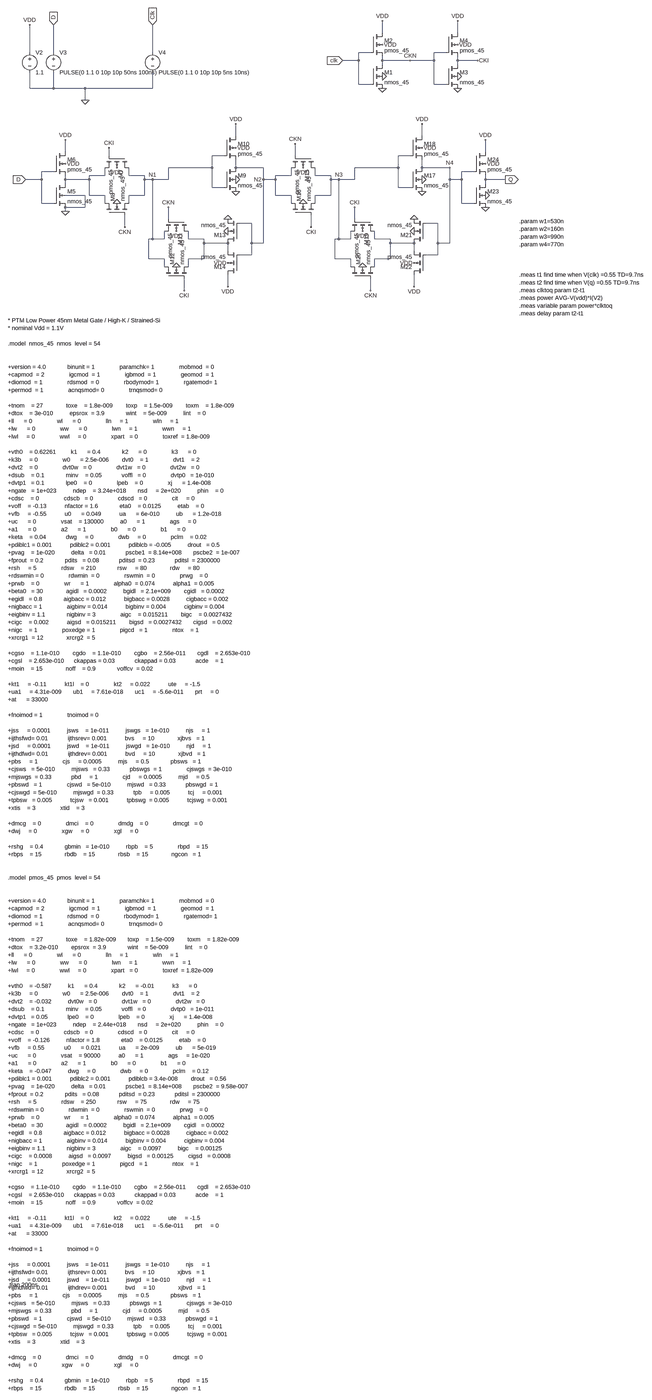
[diagram p0: schematic TGFF.asc, whole sheet]
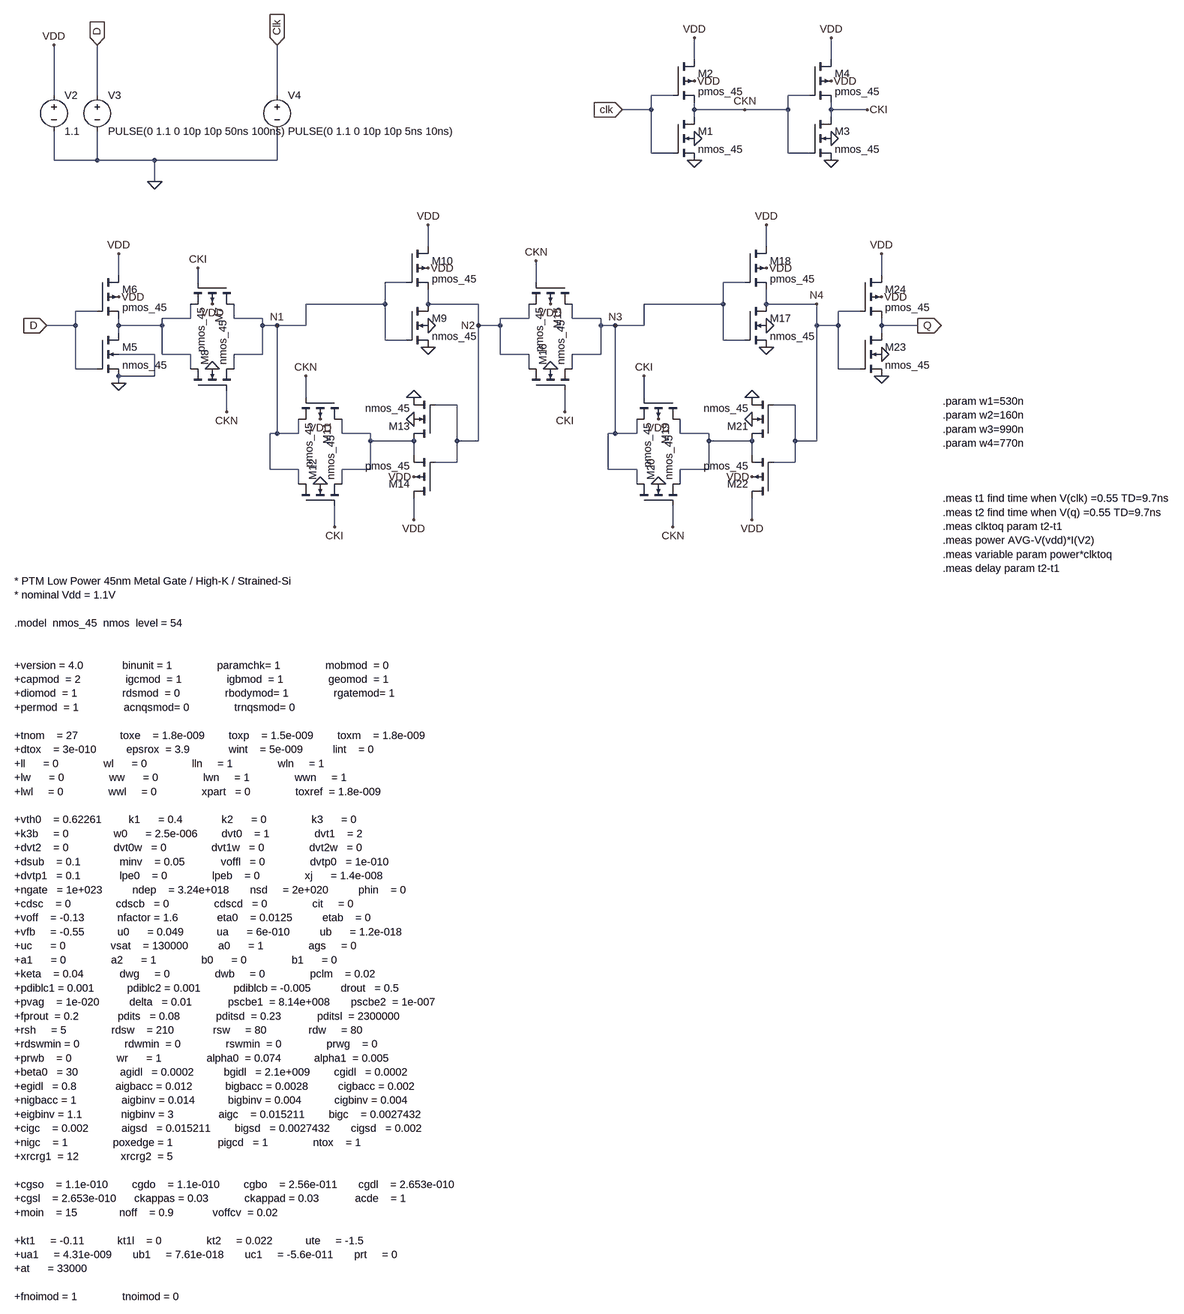
[diagram p1: schematic TGFF.asc, part, row 1 of 2, column 1 of 1]
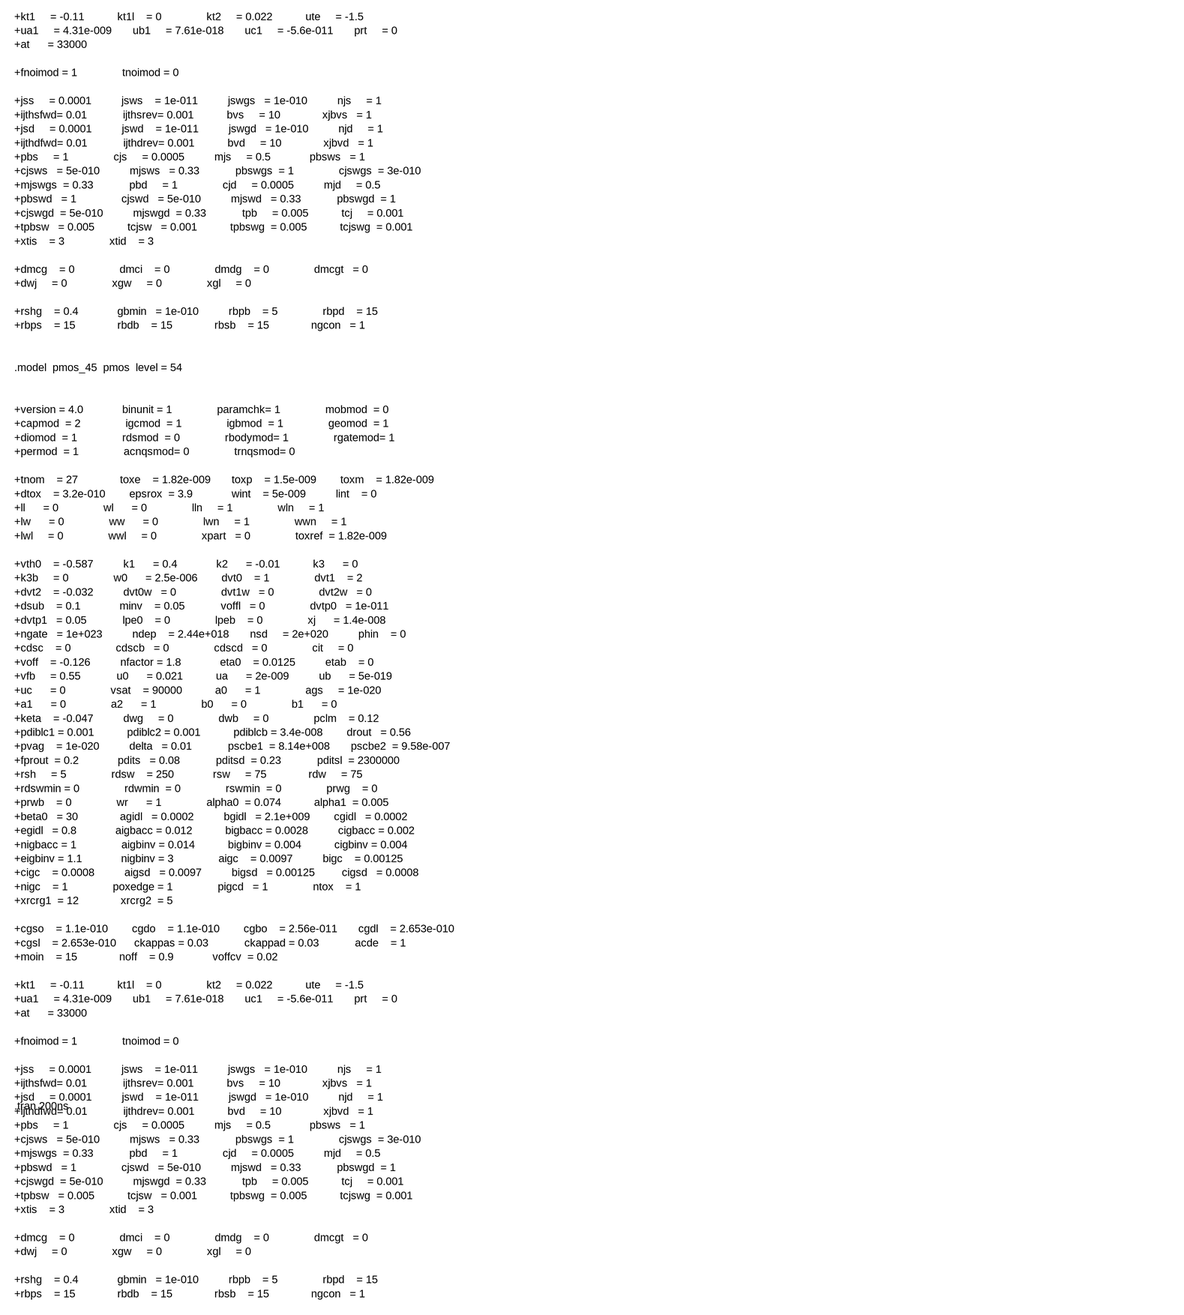
[diagram p2: schematic TGFF.asc, part, row 2 of 2, column 1 of 1]
TGFF.asc, the LTspice schematic file:
Version 4
SHEET 1 1576 4968
WIRE 192 -96 192 -144
WIRE 496 -96 496 -144
WIRE -1232 -16 -1232 -128
WIRE -1136 -16 -1136 -128
WIRE -736 -16 -736 -128
WIRE 144 -16 96 -16
WIRE 448 -16 400 -16
WIRE 96 16 96 -16
WIRE 96 16 32 16
WIRE 192 16 192 0
WIRE 304 16 192 16
WIRE 400 16 400 -16
WIRE 400 16 304 16
WIRE 496 16 496 0
WIRE 576 16 496 16
WIRE 192 32 192 16
WIRE 496 32 496 16
WIRE 96 112 96 16
WIRE 144 112 96 112
WIRE 400 112 400 16
WIRE 448 112 400 112
WIRE -1232 128 -1232 64
WIRE -1136 128 -1136 64
WIRE -1136 128 -1232 128
WIRE -1008 128 -1136 128
WIRE -736 128 -736 64
WIRE -736 128 -1008 128
WIRE -1008 176 -1008 128
WIRE -400 320 -400 272
WIRE 352 320 352 272
WIRE -1088 384 -1088 336
WIRE 608 384 608 336
WIRE -912 400 -912 368
WIRE -448 400 -496 400
WIRE -160 400 -160 352
WIRE 304 400 256 400
WIRE -496 448 -496 400
WIRE -496 448 -672 448
WIRE -400 448 -400 416
WIRE -288 448 -400 448
WIRE 256 448 256 400
WIRE 256 448 80 448
WIRE 352 448 352 416
WIRE 464 448 352 448
WIRE -1136 464 -1184 464
WIRE 560 464 512 464
WIRE -928 480 -928 448
WIRE -928 480 -992 480
WIRE -832 480 -832 448
WIRE -768 480 -832 480
WIRE -176 480 -176 448
WIRE -176 480 -240 480
WIRE -80 480 -80 448
WIRE -16 480 -80 480
WIRE -1184 496 -1184 464
WIRE -1184 496 -1248 496
WIRE -1088 496 -1088 480
WIRE -992 496 -992 480
WIRE -992 496 -1088 496
WIRE -768 496 -768 480
WIRE -736 496 -768 496
WIRE -672 496 -672 448
WIRE -672 496 -736 496
WIRE -288 496 -288 448
WIRE -240 496 -240 480
WIRE -240 496 -288 496
WIRE -16 496 -16 480
WIRE 16 496 -16 496
WIRE 80 496 80 448
WIRE 80 496 16 496
WIRE 464 496 464 448
WIRE 512 496 512 464
WIRE 512 496 464 496
WIRE 608 496 608 480
WIRE 688 496 608 496
WIRE -1088 512 -1088 496
WIRE 608 512 608 496
WIRE -496 528 -496 448
WIRE -448 528 -496 528
WIRE 256 528 256 448
WIRE 304 528 256 528
WIRE -1008 560 -1088 560
WIRE -992 560 -992 496
WIRE -928 560 -992 560
WIRE -768 560 -768 496
WIRE -768 560 -832 560
WIRE -240 560 -240 496
WIRE -176 560 -240 560
WIRE -16 560 -16 496
WIRE -16 560 -80 560
WIRE -1184 592 -1184 496
WIRE -1136 592 -1184 592
WIRE -928 592 -928 560
WIRE -832 592 -832 560
WIRE -176 592 -176 560
WIRE -80 592 -80 560
WIRE 512 592 512 496
WIRE 560 592 512 592
WIRE -1008 608 -1008 560
WIRE -1008 608 -1088 608
WIRE -1088 624 -1088 608
WIRE -672 656 -672 608
WIRE 80 656 80 608
WIRE -336 672 -384 672
WIRE 416 672 368 672
WIRE -848 688 -848 640
WIRE -96 688 -96 640
WIRE -736 736 -736 496
WIRE -736 736 -752 736
WIRE -688 736 -688 704
WIRE -688 736 -736 736
WIRE -592 736 -592 704
WIRE -528 736 -592 736
WIRE 16 736 16 496
WIRE 16 736 0 736
WIRE 64 736 64 704
WIRE 64 736 16 736
WIRE 160 736 160 704
WIRE 224 736 160 736
WIRE -528 752 -528 736
WIRE -432 752 -528 752
WIRE -336 752 -336 672
WIRE -288 752 -288 496
WIRE -288 752 -336 752
WIRE 224 752 224 736
WIRE 320 752 224 752
WIRE 416 752 416 672
WIRE 464 752 464 496
WIRE 464 752 416 752
WIRE -432 784 -432 752
WIRE 320 784 320 752
WIRE -336 800 -336 752
WIRE -336 800 -384 800
WIRE 416 800 416 752
WIRE 416 800 368 800
WIRE -752 816 -752 736
WIRE -688 816 -752 816
WIRE -528 816 -528 752
WIRE -528 816 -592 816
WIRE 0 816 0 736
WIRE 64 816 0 816
WIRE 224 816 224 752
WIRE 224 816 160 816
WIRE -688 848 -688 816
WIRE -592 848 -592 816
WIRE 64 848 64 816
WIRE 160 848 160 816
WIRE -432 928 -432 880
WIRE 320 928 320 880
WIRE -608 944 -608 896
WIRE 144 944 144 896
FLAG 192 128 0
FLAG 192 -144 VDD
FLAG 496 128 0
FLAG 496 -144 VDD
FLAG -1136 -128 D
IOPIN -1136 -128 In
FLAG -736 -128 Clk
IOPIN -736 -128 In
FLAG -1232 -128 VDD
FLAG -1008 176 0
FLAG 32 16 clk
IOPIN 32 16 In
FLAG 304 16 CKN
FLAG 576 16 CKI
FLAG -1088 624 0
FLAG -1088 336 VDD
FLAG -400 544 0
FLAG -400 272 VDD
FLAG -432 656 0
FLAG -432 928 VDD
FLAG 352 544 0
FLAG 352 272 VDD
FLAG 320 656 0
FLAG 320 928 VDD
FLAG 608 608 0
FLAG 608 336 VDD
FLAG -1248 496 D
IOPIN -1248 496 In
FLAG 688 496 Q
IOPIN 688 496 Out
FLAG 352 368 VDD
FLAG 352 496 0
FLAG 320 704 0
FLAG -432 704 0
FLAG 608 560 0
FLAG 112 848 0
FLAG -640 848 0
FLAG -880 592 0
FLAG -128 592 0
FLAG 608 432 VDD
FLAG 320 832 VDD
FLAG 112 704 VDD
FLAG -128 448 VDD
FLAG -400 368 VDD
FLAG -880 448 VDD
FLAG -1088 432 VDD
FLAG -640 704 VDD
FLAG -432 832 VDD
FLAG -400 496 0
FLAG -912 368 CKI
FLAG -848 688 CKN
FLAG -672 608 CKN
FLAG -608 944 CKI
FLAG 80 608 CKI
FLAG 144 944 CKN
FLAG -160 352 CKN
FLAG -96 688 CKI
FLAG 464 448 N4
FLAG 16 496 N3
FLAG -288 496 N2
FLAG -736 496 N1
FLAG 192 80 0
FLAG 496 80 0
FLAG 192 -48 VDD
FLAG 496 -48 VDD
SYMBOL nmos4 144 32 R0
SYMATTR InstName M1
SYMATTR Value nmos_45
SYMATTR Value2 l=45n w=90n
SYMBOL pmos4 144 -96 R0
SYMATTR InstName M2
SYMATTR Value pmos_45
SYMATTR Value2 l=45n w=180n
SYMBOL nmos4 448 32 R0
SYMATTR InstName M3
SYMATTR Value nmos_45
SYMATTR Value2 l=45n w=90n
SYMBOL pmos4 448 -96 R0
SYMATTR InstName M4
SYMATTR Value pmos_45
SYMATTR Value2 l=45n w=180n
SYMBOL voltage -1232 -32 R0
WINDOW 123 0 0 Left 0
WINDOW 39 0 0 Left 0
SYMATTR InstName V2
SYMATTR Value 1.1
SYMBOL voltage -1136 -32 R0
WINDOW 123 0 0 Left 0
WINDOW 39 0 0 Left 0
SYMATTR InstName V3
SYMATTR Value PULSE(0 1.1 0 10p 10p 50ns 100ns)
SYMBOL voltage -736 -32 R0
WINDOW 123 0 0 Left 0
WINDOW 39 0 0 Left 0
SYMATTR InstName V4
SYMATTR Value PULSE(0 1.1 0 10p 10p 5ns 10ns)
SYMBOL nmos4 -1136 512 R0
SYMATTR InstName M5
SYMATTR Value nmos_45
SYMATTR Value2 l=45n w=90n
SYMBOL pmos4 -1136 384 R0
SYMATTR InstName M6
SYMATTR Value pmos_45
SYMATTR Value2 l=45n w=180n
SYMBOL pmos4 -832 400 R90
SYMATTR InstName M7
SYMATTR Value pmos_45
SYMATTR Value2 l=45n w=180n
SYMBOL nmos4 -928 640 R270
SYMATTR InstName M8
SYMATTR Value nmos_45
SYMATTR Value2 l=45n w={w1}
SYMBOL nmos4 -448 448 R0
SYMATTR InstName M9
SYMATTR Value nmos_45
SYMATTR Value2 l=45n w=90n
SYMBOL pmos4 -448 320 R0
SYMATTR InstName M10
SYMATTR Value pmos_45
SYMATTR Value2 l=45n w=180n
SYMBOL pmos4 -592 656 R90
SYMATTR InstName M11
SYMATTR Value pmos_45
SYMATTR Value2 l=45n w=180n
SYMBOL nmos4 -688 896 R270
SYMATTR InstName M12
SYMATTR Value nmos_45
SYMATTR Value2 l=45n w={w2}
SYMBOL nmos4 -384 752 R180
SYMATTR InstName M13
SYMATTR Value nmos_45
SYMATTR Value2 l=45n w=90n
SYMBOL pmos4 -384 880 R180
SYMATTR InstName M14
SYMATTR Value pmos_45
SYMATTR Value2 l=45n w=180n
SYMBOL pmos4 -80 400 R90
SYMATTR InstName M15
SYMATTR Value pmos_45
SYMATTR Value2 l=45n w=180n
SYMBOL nmos4 -176 640 R270
SYMATTR InstName M16
SYMATTR Value nmos_45
SYMATTR Value2 l=45n w={w3}
SYMBOL nmos4 304 448 R0
SYMATTR InstName M17
SYMATTR Value nmos_45
SYMATTR Value2 l=45n w=90n
SYMBOL pmos4 304 320 R0
SYMATTR InstName M18
SYMATTR Value pmos_45
SYMATTR Value2 l=45n w=180n
SYMBOL pmos4 160 656 R90
SYMATTR InstName M19
SYMATTR Value pmos_45
SYMATTR Value2 l=45n w=180n
SYMBOL nmos4 64 896 R270
SYMATTR InstName M20
SYMATTR Value nmos_45
SYMATTR Value2 l=45n w={w4}
SYMBOL nmos4 368 752 R180
SYMATTR InstName M21
SYMATTR Value nmos_45
SYMATTR Value2 l=45n w=90n
SYMBOL pmos4 368 880 R180
SYMATTR InstName M22
SYMATTR Value pmos_45
SYMATTR Value2 l=45n w=180n
SYMBOL nmos4 560 512 R0
SYMATTR InstName M23
SYMATTR Value nmos_45
SYMATTR Value2 l=45n w=90n
SYMBOL pmos4 560 384 R0
SYMATTR InstName M24
SYMATTR Value pmos_45
SYMATTR Value2 l=45n w=180n
TEXT -1320 1064 Left 2 !* PTM Low Power 45nm Metal Gate / High-K / Strained-Si\n* nominal Vdd = 1.1V\n \n.model  nmos_45  nmos  level = 54\n \n \n+version = 4.0             binunit = 1               paramchk= 1               mobmod  = 0             \n+capmod  = 2               igcmod  = 1               igbmod  = 1               geomod  = 1             \n+diomod  = 1               rdsmod  = 0               rbodymod= 1               rgatemod= 1             \n+permod  = 1               acnqsmod= 0               trnqsmod= 0             \n \n+tnom    = 27              toxe    = 1.8e-009        toxp    = 1.5e-009        toxm    = 1.8e-009      \n+dtox    = 3e-010          epsrox  = 3.9             wint    = 5e-009          lint    = 0             \n+ll      = 0               wl      = 0               lln     = 1               wln     = 1             \n+lw      = 0               ww      = 0               lwn     = 1               wwn     = 1             \n+lwl     = 0               wwl     = 0               xpart   = 0               toxref  = 1.8e-009      \n \n+vth0    = 0.62261         k1      = 0.4             k2      = 0               k3      = 0             \n+k3b     = 0               w0      = 2.5e-006        dvt0    = 1               dvt1    = 2             \n+dvt2    = 0               dvt0w   = 0               dvt1w   = 0               dvt2w   = 0             \n+dsub    = 0.1             minv    = 0.05            voffl   = 0               dvtp0   = 1e-010        \n+dvtp1   = 0.1             lpe0    = 0               lpeb    = 0               xj      = 1.4e-008      \n+ngate   = 1e+023          ndep    = 3.24e+018       nsd     = 2e+020          phin    = 0             \n+cdsc    = 0               cdscb   = 0               cdscd   = 0               cit     = 0             \n+voff    = -0.13           nfactor = 1.6             eta0    = 0.0125          etab    = 0             \n+vfb     = -0.55           u0      = 0.049           ua      = 6e-010          ub      = 1.2e-018      \n+uc      = 0               vsat    = 130000          a0      = 1               ags     = 0             \n+a1      = 0               a2      = 1               b0      = 0               b1      = 0             \n+keta    = 0.04            dwg     = 0               dwb     = 0               pclm    = 0.02          \n+pdiblc1 = 0.001           pdiblc2 = 0.001           pdiblcb = -0.005          drout   = 0.5           \n+pvag    = 1e-020          delta   = 0.01            pscbe1  = 8.14e+008       pscbe2  = 1e-007        \n+fprout  = 0.2             pdits   = 0.08            pditsd  = 0.23            pditsl  = 2300000       \n+rsh     = 5               rdsw    = 210             rsw     = 80              rdw     = 80            \n+rdswmin = 0               rdwmin  = 0               rswmin  = 0               prwg    = 0             \n+prwb    = 0               wr      = 1               alpha0  = 0.074           alpha1  = 0.005         \n+beta0   = 30              agidl   = 0.0002          bgidl   = 2.1e+009        cgidl   = 0.0002        \n+egidl   = 0.8             aigbacc = 0.012           bigbacc = 0.0028          cigbacc = 0.002         \n+nigbacc = 1               aigbinv = 0.014           bigbinv = 0.004           cigbinv = 0.004         \n+eigbinv = 1.1             nigbinv = 3               aigc    = 0.015211        bigc    = 0.0027432     \n+cigc    = 0.002           aigsd   = 0.015211        bigsd   = 0.0027432       cigsd   = 0.002         \n+nigc    = 1               poxedge = 1               pigcd   = 1               ntox    = 1             \n+xrcrg1  = 12              xrcrg2  = 5             \n \n+cgso    = 1.1e-010        cgdo    = 1.1e-010        cgbo    = 2.56e-011       cgdl    = 2.653e-010    \n+cgsl    = 2.653e-010      ckappas = 0.03            ckappad = 0.03            acde    = 1             \n+moin    = 15              noff    = 0.9             voffcv  = 0.02          \n \n+kt1     = -0.11           kt1l    = 0               kt2     = 0.022           ute     = -1.5          \n+ua1     = 4.31e-009       ub1     = 7.61e-018       uc1     = -5.6e-011       prt     = 0             \n+at      = 33000         \n \n+fnoimod = 1               tnoimod = 0             \n \n+jss     = 0.0001          jsws    = 1e-011          jswgs   = 1e-010          njs     = 1             \n+ijthsfwd= 0.01            ijthsrev= 0.001           bvs     = 10              xjbvs   = 1             \n+jsd     = 0.0001          jswd    = 1e-011          jswgd   = 1e-010          njd     = 1             \n+ijthdfwd= 0.01            ijthdrev= 0.001           bvd     = 10              xjbvd   = 1             \n+pbs     = 1               cjs     = 0.0005          mjs     = 0.5             pbsws   = 1             \n+cjsws   = 5e-010          mjsws   = 0.33            pbswgs  = 1               cjswgs  = 3e-010        \n+mjswgs  = 0.33            pbd     = 1               cjd     = 0.0005          mjd     = 0.5           \n+pbswd   = 1               cjswd   = 5e-010          mjswd   = 0.33            pbswgd  = 1             \n+cjswgd  = 5e-010          mjswgd  = 0.33            tpb     = 0.005           tcj     = 0.001         \n+tpbsw   = 0.005           tcjsw   = 0.001           tpbswg  = 0.005           tcjswg  = 0.001         \n+xtis    = 3               xtid    = 3             \n \n+dmcg    = 0               dmci    = 0               dmdg    = 0               dmcgt   = 0             \n+dwj     = 0               xgw     = 0               xgl     = 0             \n \n+rshg    = 0.4             gbmin   = 1e-010          rbpb    = 5               rbpd    = 15            \n+rbps    = 15              rbdb    = 15              rbsb    = 15              ngcon   = 1             \n \n \n.model  pmos_45  pmos  level = 54\n \n \n+version = 4.0             binunit = 1               paramchk= 1               mobmod  = 0             \n+capmod  = 2               igcmod  = 1               igbmod  = 1               geomod  = 1             \n+diomod  = 1               rdsmod  = 0               rbodymod= 1               rgatemod= 1             \n+permod  = 1               acnqsmod= 0               trnqsmod= 0             \n \n+tnom    = 27              toxe    = 1.82e-009       toxp    = 1.5e-009        toxm    = 1.82e-009     \n+dtox    = 3.2e-010        epsrox  = 3.9             wint    = 5e-009          lint    = 0             \n+ll      = 0               wl      = 0               lln     = 1               wln     = 1             \n+lw      = 0               ww      = 0               lwn     = 1               wwn     = 1             \n+lwl     = 0               wwl     = 0               xpart   = 0               toxref  = 1.82e-009     \n \n+vth0    = -0.587          k1      = 0.4             k2      = -0.01           k3      = 0             \n+k3b     = 0               w0      = 2.5e-006        dvt0    = 1               dvt1    = 2             \n+dvt2    = -0.032          dvt0w   = 0               dvt1w   = 0               dvt2w   = 0             \n+dsub    = 0.1             minv    = 0.05            voffl   = 0               dvtp0   = 1e-011        \n+dvtp1   = 0.05            lpe0    = 0               lpeb    = 0               xj      = 1.4e-008      \n+ngate   = 1e+023          ndep    = 2.44e+018       nsd     = 2e+020          phin    = 0             \n+cdsc    = 0               cdscb   = 0               cdscd   = 0               cit     = 0             \n+voff    = -0.126          nfactor = 1.8             eta0    = 0.0125          etab    = 0             \n+vfb     = 0.55            u0      = 0.021           ua      = 2e-009          ub      = 5e-019        \n+uc      = 0               vsat    = 90000           a0      = 1               ags     = 1e-020        \n+a1      = 0               a2      = 1               b0      = 0               b1      = 0             \n+keta    = -0.047          dwg     = 0               dwb     = 0               pclm    = 0.12          \n+pdiblc1 = 0.001           pdiblc2 = 0.001           pdiblcb = 3.4e-008        drout   = 0.56          \n+pvag    = 1e-020          delta   = 0.01            pscbe1  = 8.14e+008       pscbe2  = 9.58e-007     \n+fprout  = 0.2             pdits   = 0.08            pditsd  = 0.23            pditsl  = 2300000       \n+rsh     = 5               rdsw    = 250             rsw     = 75              rdw     = 75            \n+rdswmin = 0               rdwmin  = 0               rswmin  = 0               prwg    = 0             \n+prwb    = 0               wr      = 1               alpha0  = 0.074           alpha1  = 0.005         \n+beta0   = 30              agidl   = 0.0002          bgidl   = 2.1e+009        cgidl   = 0.0002        \n+egidl   = 0.8             aigbacc = 0.012           bigbacc = 0.0028          cigbacc = 0.002         \n+nigbacc = 1               aigbinv = 0.014           bigbinv = 0.004           cigbinv = 0.004         \n+eigbinv = 1.1             nigbinv = 3               aigc    = 0.0097          bigc    = 0.00125       \n+cigc    = 0.0008          aigsd   = 0.0097          bigsd   = 0.00125         cigsd   = 0.0008        \n+nigc    = 1               poxedge = 1               pigcd   = 1               ntox    = 1             \n+xrcrg1  = 12              xrcrg2  = 5             \n \n+cgso    = 1.1e-010        cgdo    = 1.1e-010        cgbo    = 2.56e-011       cgdl    = 2.653e-010    \n+cgsl    = 2.653e-010      ckappas = 0.03            ckappad = 0.03            acde    = 1             \n+moin    = 15              noff    = 0.9             voffcv  = 0.02          \n \n+kt1     = -0.11           kt1l    = 0               kt2     = 0.022           ute     = -1.5          \n+ua1     = 4.31e-009       ub1     = 7.61e-018       uc1     = -5.6e-011       prt     = 0             \n+at      = 33000         \n \n+fnoimod = 1               tnoimod = 0             \n \n+jss     = 0.0001          jsws    = 1e-011          jswgs   = 1e-010          njs     = 1             \n+ijthsfwd= 0.01            ijthsrev= 0.001           bvs     = 10              xjbvs   = 1             \n+jsd     = 0.0001          jswd    = 1e-011          jswgd   = 1e-010          njd     = 1             \n+ijthdfwd= 0.01            ijthdrev= 0.001           bvd     = 10              xjbvd   = 1             \n+pbs     = 1               cjs     = 0.0005          mjs     = 0.5             pbsws   = 1             \n+cjsws   = 5e-010          mjsws   = 0.33            pbswgs  = 1               cjswgs  = 3e-010        \n+mjswgs  = 0.33            pbd     = 1               cjd     = 0.0005          mjd     = 0.5           \n+pbswd   = 1               cjswd   = 5e-010          mjswd   = 0.33            pbswgd  = 1             \n+cjswgd  = 5e-010          mjswgd  = 0.33            tpb     = 0.005           tcj     = 0.001         \n+tpbsw   = 0.005           tcjsw   = 0.001           tpbswg  = 0.005           tcjswg  = 0.001         \n+xtis    = 3               xtid    = 3             \n \n+dmcg    = 0               dmci    = 0               dmdg    = 0               dmcgt   = 0             \n+dwj     = 0               xgw     = 0               xgl     = 0             \n \n+rshg    = 0.4             gbmin   = 1e-010          rbpb    = 5               rbpd    = 15            \n+rbps    = 15              rbdb    = 15              rbsb    = 15              ngcon   = 1
TEXT -1320 4952 Left 2 !.tran 200ns
TEXT 744 880 Left 2 !.meas t1 find time when V(clk) =0.55 TD=9.7ns\n.meas t2 find time when V(q) =0.55 TD=9.7ns\n.meas clktoq param t2-t1\n.meas power AVG-V(vdd)*I(V2)\n.meas variable param power*clktoq\n.meas delay param t2-t1
TEXT 744 664 Left 2 !.param w1=530n \n.param w2=160n\n.param w3=990n\n.param w4=770n

The netlist it stands for:
* TGFF.asc
M1 CKN Clk 0 0 nmos_45 l=45n w=90n
M2 VDD Clk CKN VDD pmos_45 l=45n w=180n
M3 CKI CKN 0 0 nmos_45 l=45n w=90n
M4 VDD CKN CKI VDD pmos_45 l=45n w=180n
V2 VDD 0 1.1
V3 D 0 PULSE(0 1.1 0 10p 10p 50ns 100ns)
V4 Clk 0 PULSE(0 1.1 0 10p 10p 5ns 10ns)
M5 N001 D 0 0 nmos_45 l=45n w=90n
M6 VDD D N001 VDD pmos_45 l=45n w=180n
M7 N1 CKI N001 VDD pmos_45 l=45n w=180n
M8 N001 CKN N1 0 nmos_45 l=45n w={w1}
M9 N2 N1 0 0 nmos_45 l=45n w=90n
M10 VDD N1 N2 VDD pmos_45 l=45n w=180n
M11 N002 CKN N1 VDD pmos_45 l=45n w=180n
M12 N1 CKI N002 0 nmos_45 l=45n w={w2}
M13 N002 N2 0 0 nmos_45 l=45n w=90n
M14 VDD N2 N002 VDD pmos_45 l=45n w=180n
M15 N3 CKN N2 VDD pmos_45 l=45n w=180n
M16 N2 CKI N3 0 nmos_45 l=45n w={w3}
M17 N4 N3 0 0 nmos_45 l=45n w=90n
M18 VDD N3 N4 VDD pmos_45 l=45n w=180n
M19 N003 CKI N3 VDD pmos_45 l=45n w=180n
M20 N3 CKN N003 0 nmos_45 l=45n w={w4}
M21 N003 N4 0 0 nmos_45 l=45n w=90n
M22 VDD N4 N003 VDD pmos_45 l=45n w=180n
M23 Q N4 0 0 nmos_45 l=45n w=90n
M24 VDD N4 Q VDD pmos_45 l=45n w=180n
.model NMOS NMOS
.model PMOS PMOS
.lib standard.mos
* PTM Low Power 45nm Metal Gate / High-K / Strained-Si
* nominal Vdd = 1.1V
.model  nmos_45  nmos  level = 54
+version = 4.0             binunit = 1               paramchk= 1               mobmod  = 0
+capmod  = 2               igcmod  = 1               igbmod  = 1               geomod  = 1
+diomod  = 1               rdsmod  = 0               rbodymod= 1               rgatemod= 1
+permod  = 1               acnqsmod= 0               trnqsmod= 0
+tnom    = 27              toxe    = 1.8e-009        toxp    = 1.5e-009        toxm    = 1.8e-009
+dtox    = 3e-010          epsrox  = 3.9             wint    = 5e-009          lint    = 0
+ll      = 0               wl      = 0               lln     = 1               wln     = 1
+lw      = 0               ww      = 0               lwn     = 1               wwn     = 1
+lwl     = 0               wwl     = 0               xpart   = 0               toxref  = 1.8e-009
+vth0    = 0.62261         k1      = 0.4             k2      = 0               k3      = 0
+k3b     = 0               w0      = 2.5e-006        dvt0    = 1               dvt1    = 2
+dvt2    = 0               dvt0w   = 0               dvt1w   = 0               dvt2w   = 0
+dsub    = 0.1             minv    = 0.05            voffl   = 0               dvtp0   = 1e-010
+dvtp1   = 0.1             lpe0    = 0               lpeb    = 0               xj      = 1.4e-008
+ngate   = 1e+023          ndep    = 3.24e+018       nsd     = 2e+020          phin    = 0
+cdsc    = 0               cdscb   = 0               cdscd   = 0               cit     = 0
+voff    = -0.13           nfactor = 1.6             eta0    = 0.0125          etab    = 0
+vfb     = -0.55           u0      = 0.049           ua      = 6e-010          ub      = 1.2e-018
+uc      = 0               vsat    = 130000          a0      = 1               ags     = 0
+a1      = 0               a2      = 1               b0      = 0               b1      = 0
+keta    = 0.04            dwg     = 0               dwb     = 0               pclm    = 0.02
+pdiblc1 = 0.001           pdiblc2 = 0.001           pdiblcb = -0.005          drout   = 0.5
+pvag    = 1e-020          delta   = 0.01            pscbe1  = 8.14e+008       pscbe2  = 1e-007
+fprout  = 0.2             pdits   = 0.08            pditsd  = 0.23            pditsl  = 2300000
+rsh     = 5               rdsw    = 210             rsw     = 80              rdw     = 80
+rdswmin = 0               rdwmin  = 0               rswmin  = 0               prwg    = 0
+prwb    = 0               wr      = 1               alpha0  = 0.074           alpha1  = 0.005
+beta0   = 30              agidl   = 0.0002          bgidl   = 2.1e+009        cgidl   = 0.0002
+egidl   = 0.8             aigbacc = 0.012           bigbacc = 0.0028          cigbacc = 0.002
+nigbacc = 1               aigbinv = 0.014           bigbinv = 0.004           cigbinv = 0.004
+eigbinv = 1.1             nigbinv = 3               aigc    = 0.015211        bigc    = 0.0027432
+cigc    = 0.002           aigsd   = 0.015211        bigsd   = 0.0027432       cigsd   = 0.002
+nigc    = 1               poxedge = 1               pigcd   = 1               ntox    = 1
+xrcrg1  = 12              xrcrg2  = 5
+cgso    = 1.1e-010        cgdo    = 1.1e-010        cgbo    = 2.56e-011       cgdl    = 2.653e-010
+cgsl    = 2.653e-010      ckappas = 0.03            ckappad = 0.03            acde    = 1
+moin    = 15              noff    = 0.9             voffcv  = 0.02
+kt1     = -0.11           kt1l    = 0               kt2     = 0.022           ute     = -1.5
+ua1     = 4.31e-009       ub1     = 7.61e-018       uc1     = -5.6e-011       prt     = 0
+at      = 33000
+fnoimod = 1               tnoimod = 0
+jss     = 0.0001          jsws    = 1e-011          jswgs   = 1e-010          njs     = 1
+ijthsfwd= 0.01            ijthsrev= 0.001           bvs     = 10              xjbvs   = 1
+jsd     = 0.0001          jswd    = 1e-011          jswgd   = 1e-010          njd     = 1
+ijthdfwd= 0.01            ijthdrev= 0.001           bvd     = 10              xjbvd   = 1
+pbs     = 1               cjs     = 0.0005          mjs     = 0.5             pbsws   = 1
+cjsws   = 5e-010          mjsws   = 0.33            pbswgs  = 1               cjswgs  = 3e-010
+mjswgs  = 0.33            pbd     = 1               cjd     = 0.0005          mjd     = 0.5
+pbswd   = 1               cjswd   = 5e-010          mjswd   = 0.33            pbswgd  = 1
+cjswgd  = 5e-010          mjswgd  = 0.33            tpb     = 0.005           tcj     = 0.001
+tpbsw   = 0.005           tcjsw   = 0.001           tpbswg  = 0.005           tcjswg  = 0.001
+xtis    = 3               xtid    = 3
+dmcg    = 0               dmci    = 0               dmdg    = 0               dmcgt   = 0
+dwj     = 0               xgw     = 0               xgl     = 0
+rshg    = 0.4             gbmin   = 1e-010          rbpb    = 5               rbpd    = 15
+rbps    = 15              rbdb    = 15              rbsb    = 15              ngcon   = 1
.model  pmos_45  pmos  level = 54
+version = 4.0             binunit = 1               paramchk= 1               mobmod  = 0
+capmod  = 2               igcmod  = 1               igbmod  = 1               geomod  = 1
+diomod  = 1               rdsmod  = 0               rbodymod= 1               rgatemod= 1
+permod  = 1               acnqsmod= 0               trnqsmod= 0
+tnom    = 27              toxe    = 1.82e-009       toxp    = 1.5e-009        toxm    = 1.82e-009
+dtox    = 3.2e-010        epsrox  = 3.9             wint    = 5e-009          lint    = 0
+ll      = 0               wl      = 0               lln     = 1               wln     = 1
+lw      = 0               ww      = 0               lwn     = 1               wwn     = 1
+lwl     = 0               wwl     = 0               xpart   = 0               toxref  = 1.82e-009
+vth0    = -0.587          k1      = 0.4             k2      = -0.01           k3      = 0
+k3b     = 0               w0      = 2.5e-006        dvt0    = 1               dvt1    = 2
+dvt2    = -0.032          dvt0w   = 0               dvt1w   = 0               dvt2w   = 0
+dsub    = 0.1             minv    = 0.05            voffl   = 0               dvtp0   = 1e-011
+dvtp1   = 0.05            lpe0    = 0               lpeb    = 0               xj      = 1.4e-008
+ngate   = 1e+023          ndep    = 2.44e+018       nsd     = 2e+020          phin    = 0
+cdsc    = 0               cdscb   = 0               cdscd   = 0               cit     = 0
+voff    = -0.126          nfactor = 1.8             eta0    = 0.0125          etab    = 0
+vfb     = 0.55            u0      = 0.021           ua      = 2e-009          ub      = 5e-019
+uc      = 0               vsat    = 90000           a0      = 1               ags     = 1e-020
+a1      = 0               a2      = 1               b0      = 0               b1      = 0
+keta    = -0.047          dwg     = 0               dwb     = 0               pclm    = 0.12
+pdiblc1 = 0.001           pdiblc2 = 0.001           pdiblcb = 3.4e-008        drout   = 0.56
+pvag    = 1e-020          delta   = 0.01            pscbe1  = 8.14e+008       pscbe2  = 9.58e-007
+fprout  = 0.2             pdits   = 0.08            pditsd  = 0.23            pditsl  = 2300000
+rsh     = 5               rdsw    = 250             rsw     = 75              rdw     = 75
+rdswmin = 0               rdwmin  = 0               rswmin  = 0               prwg    = 0
+prwb    = 0               wr      = 1               alpha0  = 0.074           alpha1  = 0.005
+beta0   = 30              agidl   = 0.0002          bgidl   = 2.1e+009        cgidl   = 0.0002
+egidl   = 0.8             aigbacc = 0.012           bigbacc = 0.0028          cigbacc = 0.002
+nigbacc = 1               aigbinv = 0.014           bigbinv = 0.004           cigbinv = 0.004
+eigbinv = 1.1             nigbinv = 3               aigc    = 0.0097          bigc    = 0.00125
+cigc    = 0.0008          aigsd   = 0.0097          bigsd   = 0.00125         cigsd   = 0.0008
+nigc    = 1               poxedge = 1               pigcd   = 1               ntox    = 1
+xrcrg1  = 12              xrcrg2  = 5
+cgso    = 1.1e-010        cgdo    = 1.1e-010        cgbo    = 2.56e-011       cgdl    = 2.653e-010
+cgsl    = 2.653e-010      ckappas = 0.03            ckappad = 0.03            acde    = 1
+moin    = 15              noff    = 0.9             voffcv  = 0.02
+kt1     = -0.11           kt1l    = 0               kt2     = 0.022           ute     = -1.5
+ua1     = 4.31e-009       ub1     = 7.61e-018       uc1     = -5.6e-011       prt     = 0
+at      = 33000
+fnoimod = 1               tnoimod = 0
+jss     = 0.0001          jsws    = 1e-011          jswgs   = 1e-010          njs     = 1
+ijthsfwd= 0.01            ijthsrev= 0.001           bvs     = 10              xjbvs   = 1
+jsd     = 0.0001          jswd    = 1e-011          jswgd   = 1e-010          njd     = 1
+ijthdfwd= 0.01            ijthdrev= 0.001           bvd     = 10              xjbvd   = 1
+pbs     = 1               cjs     = 0.0005          mjs     = 0.5             pbsws   = 1
+cjsws   = 5e-010          mjsws   = 0.33            pbswgs  = 1               cjswgs  = 3e-010
+mjswgs  = 0.33            pbd     = 1               cjd     = 0.0005          mjd     = 0.5
+pbswd   = 1               cjswd   = 5e-010          mjswd   = 0.33            pbswgd  = 1
+cjswgd  = 5e-010          mjswgd  = 0.33            tpb     = 0.005           tcj     = 0.001
+tpbsw   = 0.005           tcjsw   = 0.001           tpbswg  = 0.005           tcjswg  = 0.001
+xtis    = 3               xtid    = 3
+dmcg    = 0               dmci    = 0               dmdg    = 0               dmcgt   = 0
+dwj     = 0               xgw     = 0               xgl     = 0
+rshg    = 0.4             gbmin   = 1e-010          rbpb    = 5               rbpd    = 15
+rbps    = 15              rbdb    = 15              rbsb    = 15              ngcon   = 1
.tran 200ns
.meas t1 find time when V(clk) =0.55 TD=9.7ns
.meas t2 find time when V(q) =0.55 TD=9.7ns
.meas clktoq param t2-t1
.meas power AVG-V(vdd)*I(V2)
.meas variable param power*clktoq
.meas delay param t2-t1
.param w1=530n
.param w2=160n
.param w3=990n
.param w4=770n
.backanno
.end